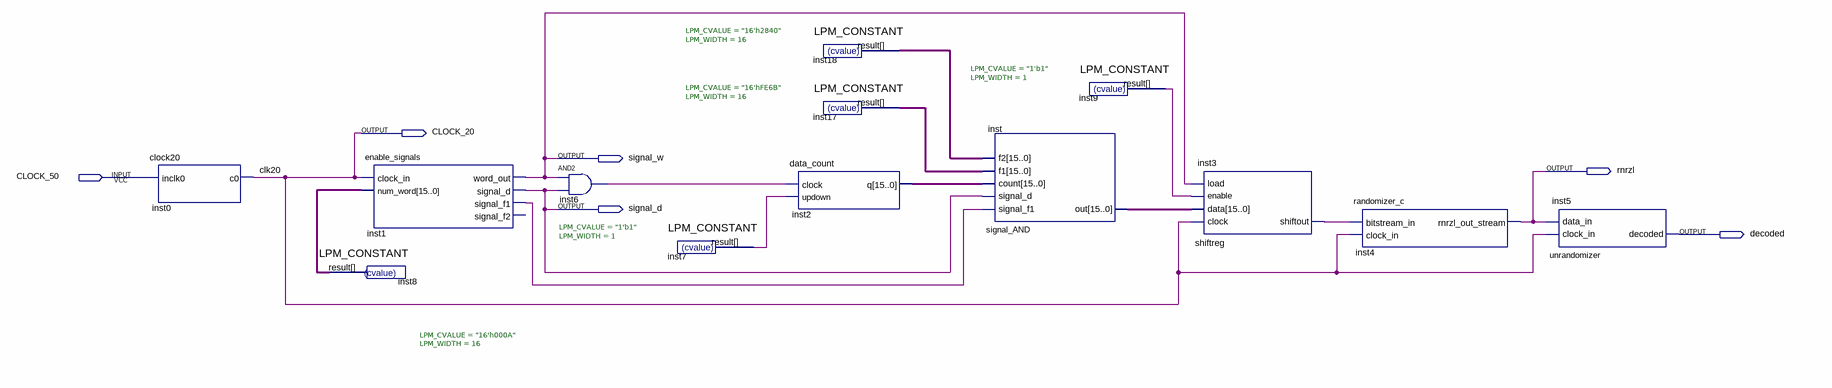
[diagram p0: schematic sheet]
// Quartus schematic randomizer.bdf as structural Verilog: 13 symbols, 6 pins
module randomizer (
  input  CLOCK_50,
  output CLOCK_20,
  output signal_w,
  output rnrzl,
  output signal_d,
  output decoded
);

  wire inst1_signal_f1, inst3_shiftout, inst6_out, inst7_result, inst9_result;
  wire [15:0] inst2_q, inst8_result, inst17_result, inst18_result, inst_out;

  clock20 inst0 (.inclk0(CLOCK_50), .c0(CLOCK_20));
  LPM_CONSTANT #(.LPM_CVALUE("16'h000A"), .LPM_WIDTH(16)) inst8 (.result(inst8_result));
  enable_signals inst1 (
    .clock_in(CLOCK_20), .num_word(inst8_result), .word_out(signal_w), .signal_d(signal_d),
    .signal_f1(inst1_signal_f1));  // open: signal_f2
  and inst6 (inst6_out, signal_w, signal_d);
  LPM_CONSTANT #(.LPM_CVALUE("1'b1"), .LPM_WIDTH(1)) inst7 (.result(inst7_result));
  data_count inst2 (.clock(inst6_out), .updown(inst7_result), .q(inst2_q));
  LPM_CONSTANT #(.LPM_CVALUE("16'h2840"), .LPM_WIDTH(16)) inst18 (.result(inst18_result));
  LPM_CONSTANT #(.LPM_CVALUE("16'hFE6B"), .LPM_WIDTH(16)) inst17 (.result(inst17_result));
  signal_AND inst (
    .signal_f1(inst1_signal_f1), .signal_d(signal_d), .count(inst2_q), .f1(inst17_result),
    .f2(inst18_result), .out(inst_out));
  LPM_CONSTANT #(.LPM_CVALUE("1'b1"), .LPM_WIDTH(1)) inst9 (.result(inst9_result));
  shiftreg inst3 (.clock(CLOCK_20), .data(inst_out), .enable(inst9_result), .load(signal_w), .shiftout(inst3_shiftout));
  randomizer_c inst4 (.bitstream_in(inst3_shiftout), .clock_in(CLOCK_20), .rnrzl_out_stream(rnrzl));
  unrandomizer inst5 (.clock_in(CLOCK_20), .data_in(rnrzl), .decoded(decoded));

  // Other names for the same wires on the sheet: clk20 = CLOCK_20
endmodule
